# EAGLE design GLogger-shield (EAGLE 6.4)
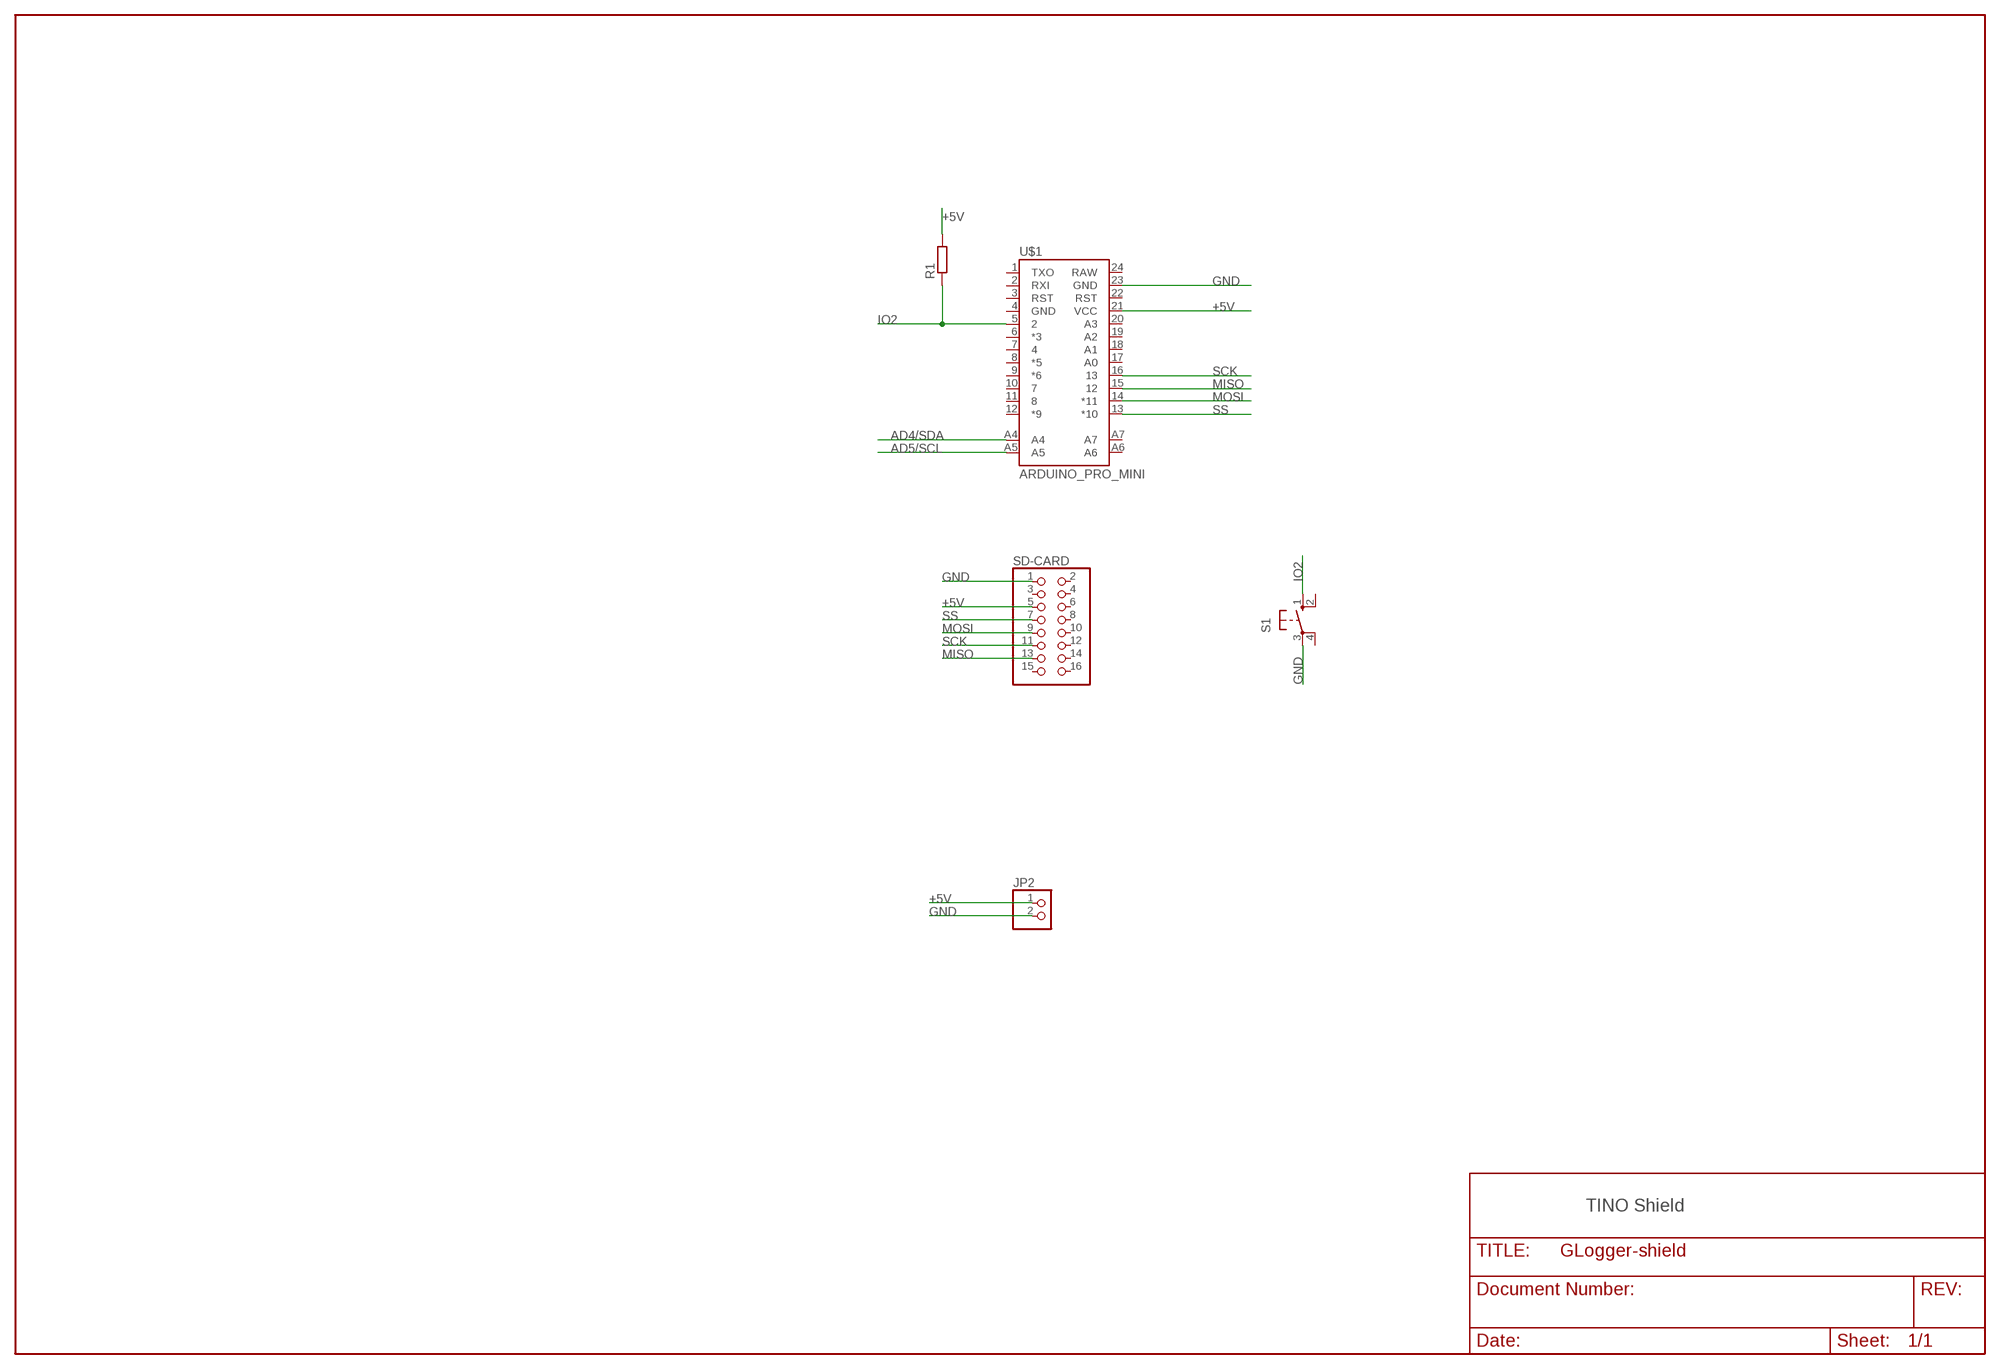
[diagram p0: schematic, sheet 1]

## Parts
JP2  PINHD-1X2  [1X02]
R1  R-EU_0207/10  [0207/10]
S1  40-XX-ROUND  [B3F-40XX-ROUND]
SD-CARD  PINHD-2X8  [2X08]
U$1  ARDUINO_PRO_MINI  [ARDUINO_PRO_MINI]

## Nets
+5V [usbvcc]: JP2.1 R1.2 SD-CARD.5 U$1.21(VCC)
AD4/SDA: U$1.A4
AD5/SCL: U$1.A5
GND [gnd]: JP2.2 S1.3(P) SD-CARD.1 U$1.23(GND)
IO2: R1.1 S1.1(S) U$1.5
MISO: SD-CARD.13 U$1.15
MOSI: SD-CARD.9 U$1.14(*11)
SCK: SD-CARD.11 U$1.16
SS: SD-CARD.7 U$1.13(*10)
Unconnected: S1.2(S1) S1.4(P1) SD-CARD.2 SD-CARD.3 SD-CARD.4 SD-CARD.6 SD-CARD.8 SD-CARD.10 SD-CARD.12 SD-CARD.14 SD-CARD.15 SD-CARD.16 U$1.1(TXO) U$1.2(RXI) U$1.3(RST) U$1.4(GND) U$1.6(*3) U$1.7 U$1.8(*5) U$1.9(*6) U$1.10 U$1.11 U$1.12(*9) U$1.17(A0) U$1.18(A1) U$1.19(A2) U$1.20(A3) U$1.22(RST) U$1.24(RAW) U$1.A6 U$1.A7

## Notes on the sheet
- TINO Shield

## Library data of the parts
JP2 = pinhead:PINHD-1X2: PIN HEADER
R1 = resistor:R-EU_: RESISTOR, European symbol
S1 = arduino_adafruit:40-XX: OMRON SWITCH
SD-CARD = pinhead:PINHD-2X8: PIN HEADER
U$1 = SparkFun-Boards:ARDUINO_PRO_MINI

## Net classes
0 default: width 0.254 mm, clearance 0.254 mm
1 power: width 0.61 mm, drill 0.61 mm, clearance 0.254 mm
2 gnd: width 0.305 mm, drill 0.559 mm, clearance 0.254 mm
3 usbvcc: width 0.508 mm, drill 0.61 mm, clearance 0.254 mm
4 aref: width 0.406 mm, drill 0.61 mm, clearance 0.254 mm

## Board
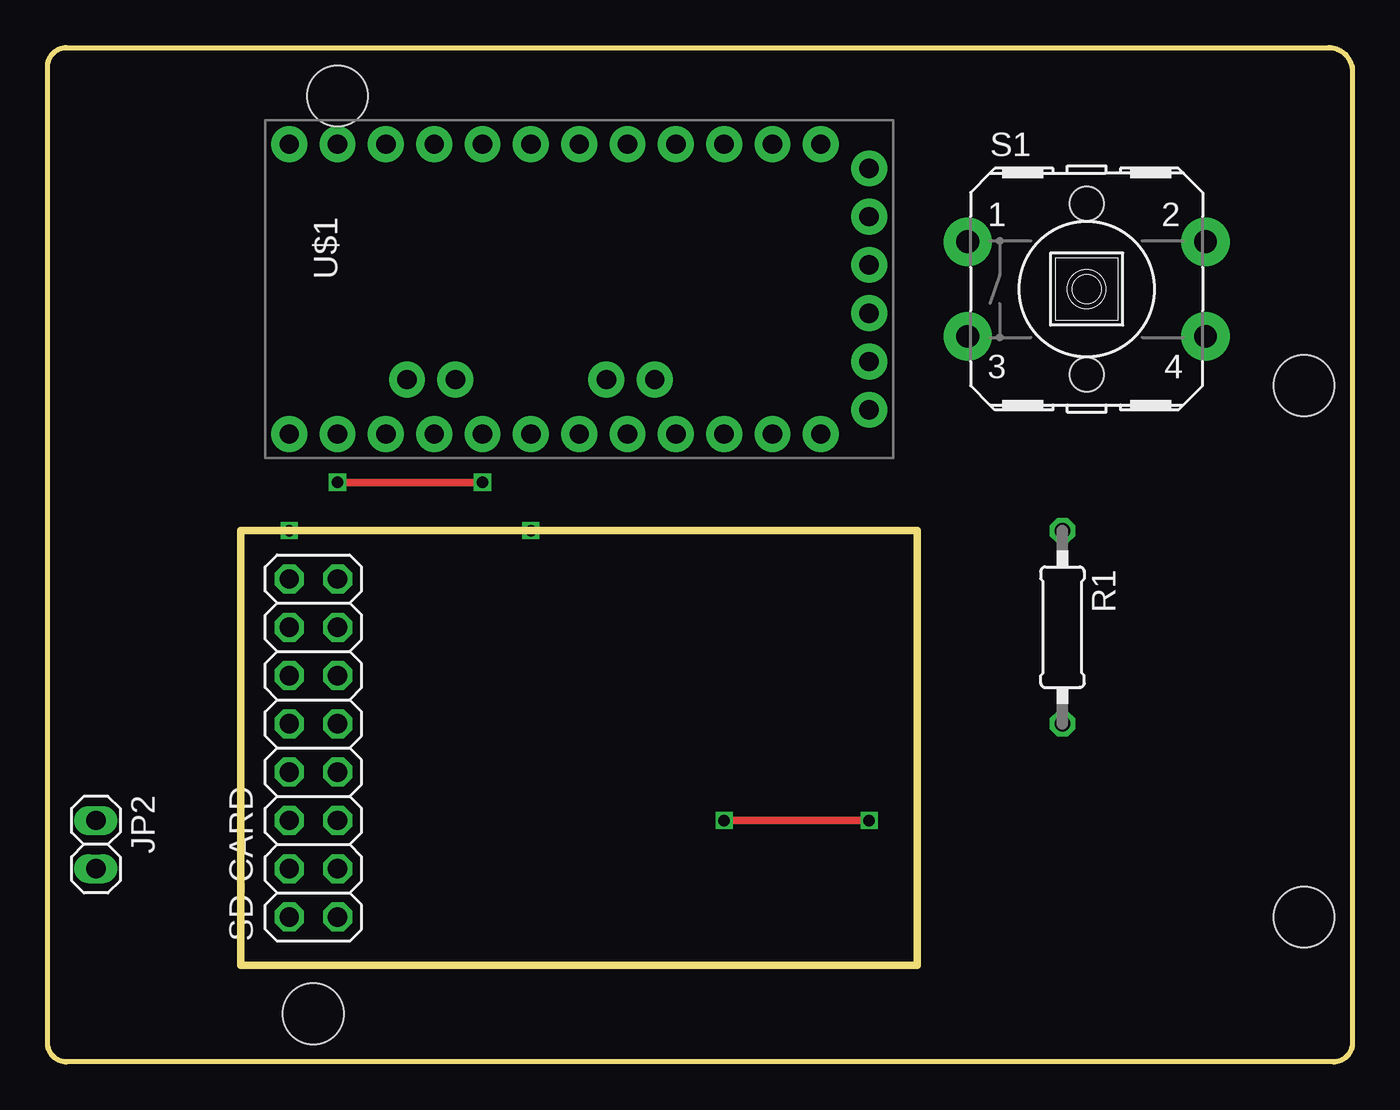
[diagram p1: board, top side]
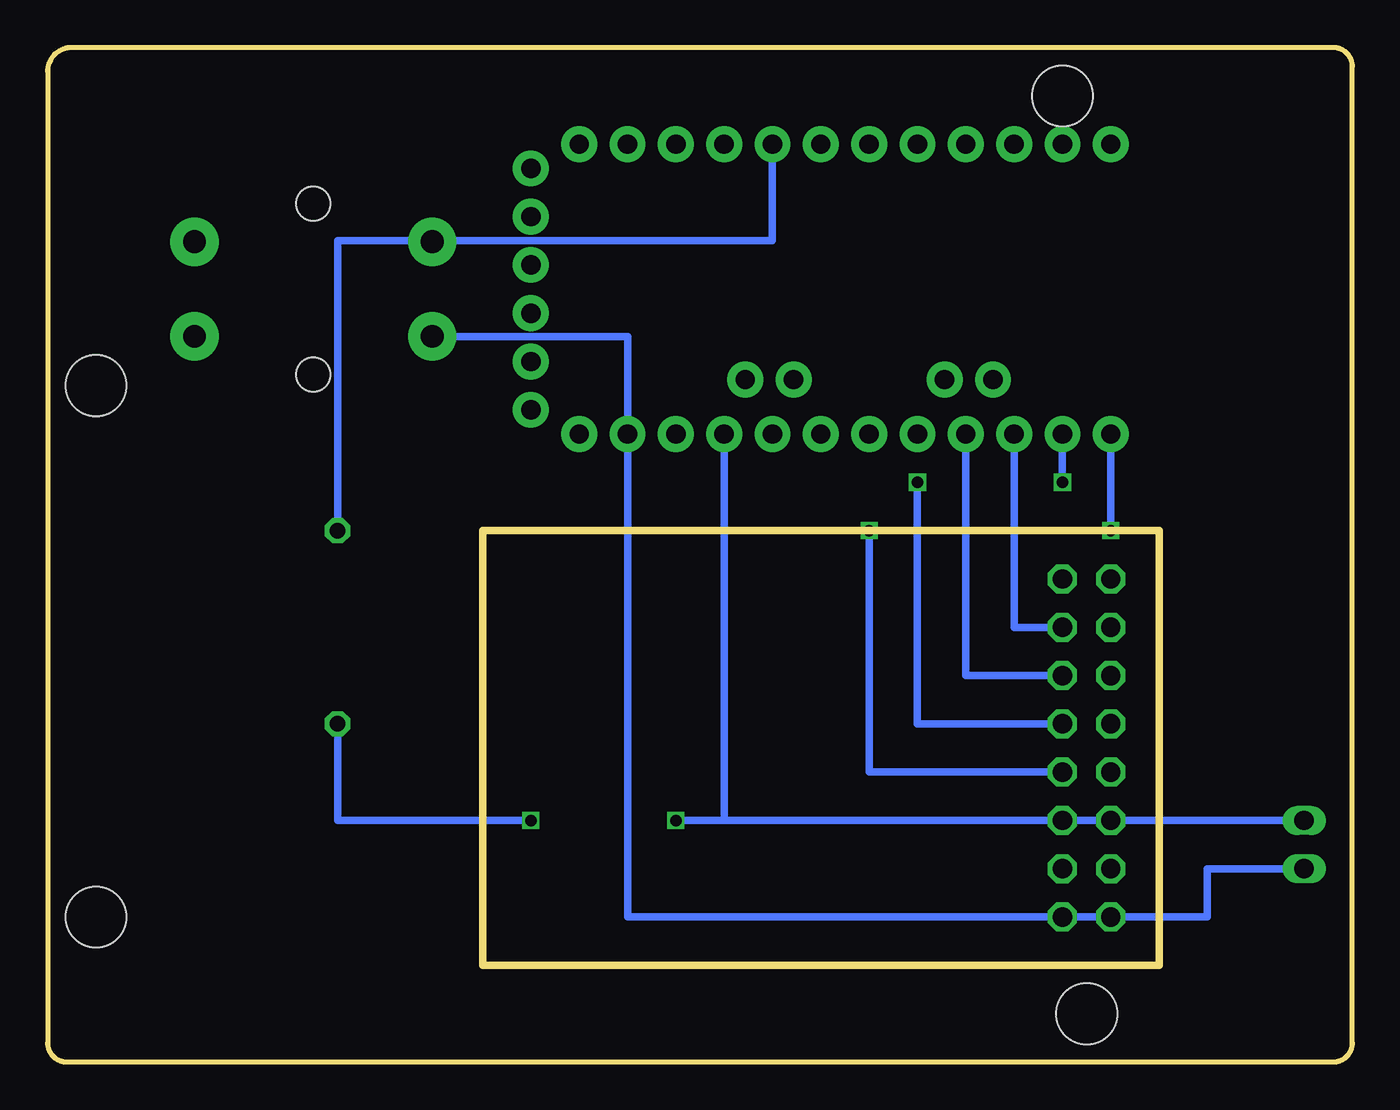
[diagram p2: board, bottom side, seen from below]

Size 68.58 x 53.34 mm. Coordinates in mm from the lower left corner, seen from the top.
Outline: 1,53.34 67.31,53.34 arc-90 68.58,52.07 68.58,1 arc-90 67.58,0 1,0 arc-90 0,1 0,52.34 arc-90 1,53.34
Outline: 10.16,27.94 45.72,27.94 45.72,5.08 10.16,5.08 10.16,27.94
Copper layers (1*16): Top 0.035mm / dielectric 1.5mm / Bottom 0.035mm
Design rules "Elecrow_2-layer_eagle_rule *": minimum track width 6mil, minimum drill 12mil, track to track 6mil, track to pad 6mil, pad to pad 6mil, via to via 6mil, smd to smd 0mil, copper to edge 10mil, drill to drill 10mil, minimum pad ring 10mil, minimum via ring 6mil, stop-mask expansion 2mil, vias tented up to drill 100mil, thermal gap 10mil
Holes 3.2 mm at 66.04,35.56 66.04,7.62 15.24,50.8 13.97,2.54

### Footprints (pad centres in the part's own frame; a part is rotated, then mirrored left to right if it is on the bottom)
1X02 = drill 1.016 long: 1 -1.27,0; 2 1.27,0
0207/10 = drill 0.813 octagon: 1 -5.08,0; 2 5.08,0
B3F-40XX-ROUND = drill 1.194 pad 2.54: 1 -6.248,2.489; 2 6.248,2.489; 3 -6.248,-2.489; 4 6.248,-2.489 | hole 1.803: 0,-4.496; 0,4.496
2X08 = drill 1.016 octagon: 1 -8.89,-1.27; 2 -8.89,1.27; 3 -6.35,-1.27; 4 -6.35,1.27; 5 -3.81,-1.27; 6 -3.81,1.27; 7 -1.27,-1.27; 8 -1.27,1.27; 9 1.27,-1.27; 10 1.27,1.27; 11 3.81,-1.27; 12 3.81,1.27; 13 6.35,-1.27; 14 6.35,1.27; 15 8.89,-1.27; 16 8.89,1.27
ARDUINO_PRO_MINI = drill 1.016 pad 1.88: 1 -7.62,12.7; 2 -7.62,10.16; 3 -7.62,7.62; 4 -7.62,5.08; 5 -7.62,2.54; 6 -7.62,0; 7 -7.62,-2.54; 8 -7.62,-5.08; 9 -7.62,-7.62; 10 -7.62,-10.16; 11 -7.62,-12.7; 12 -7.62,-15.24; 13 7.62,-15.24; 14 7.62,-12.7; 15 7.62,-10.16; 16 7.62,-7.62; 17 7.62,-5.08; 18 7.62,-2.54; 19 7.62,0; 20 7.62,2.54; 21 7.62,5.08; 22 7.62,7.62; 23 7.62,10.16; 24 7.62,12.7; A4 4.763,1.429; A5 4.763,3.969; A6 4.763,-9.049; A7 4.763,-6.509; BLK -6.35,15.24; GND -3.81,15.24; GRN 6.35,15.24; RXI 1.27,15.24; TXO 3.81,15.24; VCC -1.27,15.24

### Placement (x,y rotation side)
JP2  2.54,11.43 270 top
R1  53.34,22.86 270 top
S1  54.61,40.64 0 top
SD-CARD  13.97,16.51 90 top
U$1  27.94,40.64 270 top

### Tracks (layer width: path | path; a pad name or v marks a point on that pad's centre or on a via)
+5V  (via drill 0.6)
  Top 0.406: v43.18,12.7 v35.56,12.7
  Bottom 0.406: 33.02,12.7 SD-CARD.5 JP2.1 | 33.02,12.7 U$1.21 | R1.2 53.34,12.7 v43.18,12.7 | v35.56,12.7 33.02,12.7
GND
  Bottom 0.406: S1.3 38.1,38.15 U$1.23 38.1,7.62 SD-CARD.1 7.62,7.62 7.62,10.16 JP2.2
IO2
  Bottom 0.406: U$1.5 30.48,43.18 48.36,43.18 | R1.1 53.34,43.18 48.36,43.18 | 48.36,43.18 S1.1
MISO
  Bottom 0.406: U$1.15 17.78,22.86 SD-CARD.13
MOSI  (via drill 0.6)
  Top 0.406: v15.24,30.48 v22.86,30.48
  Bottom 0.406: U$1.14 v15.24,30.48 | v22.86,30.48 22.86,17.78 SD-CARD.9
SCK
  Bottom 0.406: U$1.16 20.32,20.32 SD-CARD.11
SS  (via drill 0.6)
  Top 0.406: v12.7,27.94 v25.4,27.94
  Bottom 0.406: U$1.13 v12.7,27.94 | v25.4,27.94 25.4,15.24 SD-CARD.7

### Text on the board
214bmp: D:/SmartProjects/Snc/a4_bn_logo2.bmp